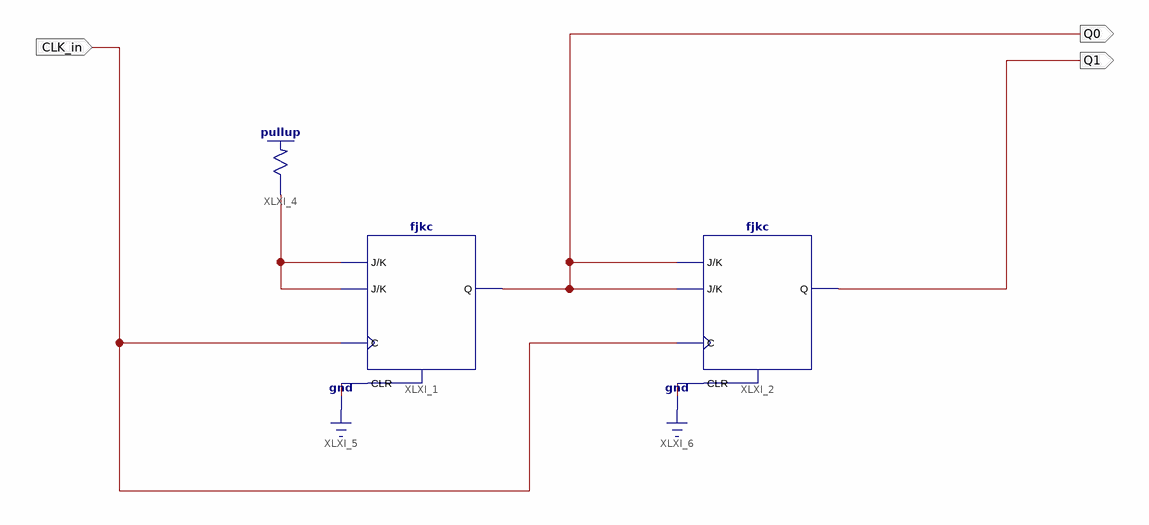
[diagram p0: schematic sheet 1]
// Xilinx ISE schematic CLK_QuarterHz.sch (spartan3e) as structural Verilog: 3 symbols, 3 ports
module CLK_QuarterHz (
  input  CLK_in,
  output Q1,
  output Q0
);

  wire XLXN_7;

  fjkc XLXI_1 (.C(CLK_in), .CLR(1'b0), .J(XLXN_7), .K(XLXN_7), .Q(Q0));
  fjkc XLXI_2 (.C(CLK_in), .CLR(1'b0), .J(Q0), .K(Q0), .Q(Q1));
  \pullup  XLXI_4 (.O(XLXN_7));
endmodule
